# Altium schematic sheet Sheet1.SCHDOC
size 420 x 297 mm; SheetNumber: 1; SheetTotal: 1; Scale: {Масш.}; Title1str: {Наименование}; PageSetup: Record=PageOptions|CenterHorizontal=False|CenterVertical=False|PrintScale=0.95|XCorrection=0.00|YCorrection=0.00|PrintKind=1|BorderSize=5000000|LeftOffset=0|BottomOffset=0|Orientation=1|PaperLength=1000|PaperWidth=1000|Scale=100|PaperSource=15|PrintQuality=600|MediaType=1|DitherType=10|PaperKind=A4|PrintScaleMode=1; Title2str: {Наименование}; ProcessInspection: {Т.контр.}; Mass: {Масса}; NormInspection: {Н.контр.}; EngineerName: {Инженер}; Letter1Column: {}; Letter2Column: {}; Letter3Column: {}; DocumentType: {Документ}; DocumentType1str: {Документ}; DocumentType2str: {Документ}; DocumentName: Sheet1.SCHDOC
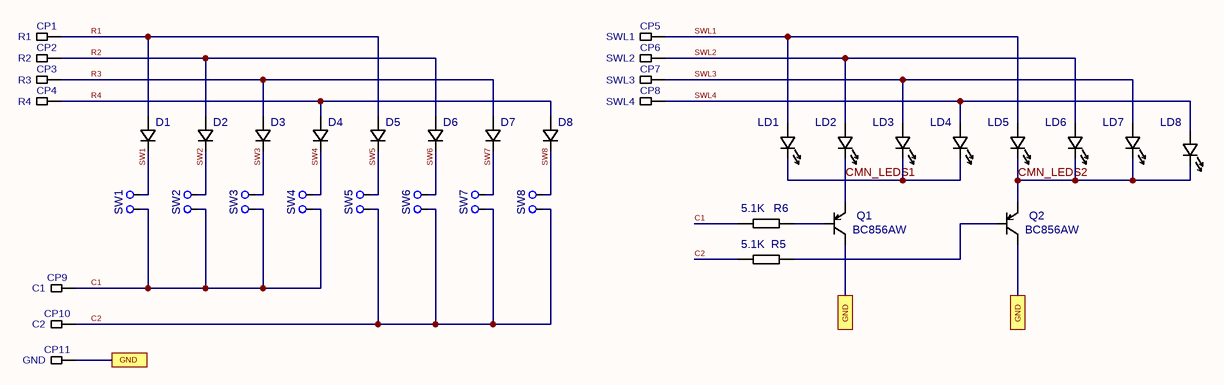
[diagram p0: Sheet1.SCHDOC]

## Parts
CP1  value R1  [PAD_RRX60Y60D0T]  (hidden comment: PAD_RRX60Y60D0T)
CP2  value R2  [PAD_RRX60Y60D0T]  (hidden comment: PAD_RRX60Y60D0T)
CP3  value R3  [PAD_RRX60Y60D0T]  (hidden comment: PAD_RRX60Y60D0T)
CP4  value R4  [PAD_RRX60Y60D0T]  (hidden comment: PAD_RRX60Y60D0T)
CP5  value SWL1  [PAD_RRX60Y60D0T]  (hidden comment: PAD_RRX60Y60D0T)
CP6  value SWL2  [PAD_RRX60Y60D0T]  (hidden comment: PAD_RRX60Y60D0T)
CP7  value SWL3  [PAD_RRX60Y60D0T]  (hidden comment: PAD_RRX60Y60D0T)
CP8  value SWL4  [PAD_RRX60Y60D0T]  (hidden comment: PAD_RRX60Y60D0T)
CP9  value C1  [PAD_RRX60Y60D0T]  (hidden comment: PAD_RRX60Y60D0T)
CP10  value C2  [PAD_RRX60Y60D0T]  (hidden comment: PAD_RRX60Y60D0T)
CP11  value GND  [PAD_RRX60Y60D0T]  (hidden comment: PAD_RRX60Y60D0T)
D1  1N4148  [SOD80]  (value not drawn)
D2  1N4148  [SOD80]  (value not drawn)
D3  1N4148  [SOD80]  (value not drawn)
D4  1N4148  [SOD80]  (value not drawn)
D5  1N4148  [SOD80]  (value not drawn)
D6  1N4148  [SOD80]  (value not drawn)
D7  1N4148  [SOD80]  (value not drawn)
D8  1N4148  [SOD80]  (value not drawn)
LD1  LED_3MM  [LED_3MM_DIP]  (value not drawn)
LD2  LED_3MM  [LED_3MM_DIP]  (value not drawn)
LD3  LED_3MM  [LED_3MM_DIP]  (value not drawn)
LD4  LED_3MM  [LED_3MM_DIP]  (value not drawn)
LD5  LED_3MM  [LED_3MM_DIP]  (value not drawn)
LD6  LED_3MM  [LED_3MM_DIP]  (value not drawn)
LD7  LED_3MM  [LED_3MM_DIP]  (value not drawn)
LD8  LED_3MM  [LED_3MM_DIP]  (value not drawn)
Q1  BC856AW  [SOT23]
Q2  BC856AW  [SOT23]
R5  value 5.1K  [R0805]  (hidden comment: RES_SMD_0805)
R6  value 5.1K  [R0805]  (hidden comment: RES_SMD_0805)
SW1  2P:EX60Y60D0T-CD100  [2P:EX60Y60D0T-CD100]  (value not drawn)
SW2  2P:EX60Y60D0T-CD100  [2P:EX60Y60D0T-CD100]  (value not drawn)
SW3  2P:EX60Y60D0T-CD100  [2P:EX60Y60D0T-CD100]  (value not drawn)
SW4  2P:EX60Y60D0T-CD100  [2P:EX60Y60D0T-CD100]  (value not drawn)
SW5  2P:EX60Y60D0T-CD100  [2P:EX60Y60D0T-CD100]  (value not drawn)
SW6  2P:EX60Y60D0T-CD100  [2P:EX60Y60D0T-CD100]  (value not drawn)
SW7  2P:EX60Y60D0T-CD100  [2P:EX60Y60D0T-CD100]  (value not drawn)
SW8  2P:EX60Y60D0T-CD100  [2P:EX60Y60D0T-CD100]  (value not drawn)

## Ports
GND

## Nets
C1: CP9.1 R6.1 SW1.2 SW2.2 SW3.2 SW4.2
C2: CP10.1 R5.1 SW5.2 SW6.2 SW7.2 SW8.2
CMN_LEDS1: LD1.K LD2.K LD3.K LD4.K Q1.2(E)
CMN_LEDS2: LD5.K LD6.K LD7.K LD8.K Q2.2(E)
GND: CP11.1 Q1.3(C) Q2.3(C) ; port GND
R1: CP1.1 D1.A D5.A
R2: CP2.1 D2.A D6.A
R3: CP3.1 D3.A D7.A
R4: CP4.1 D4.A D8.A
SW1: D1.K SW1.1
SW2: D2.K SW2.1
SW3: D3.K SW3.1
SW4: D4.K SW4.1
SW5: D5.K SW5.1
SW6: D6.K SW6.1
SW7: D7.K SW7.1
SW8: D8.K SW8.1
SWL1: CP5.1 LD1.A LD5.A
SWL2: CP6.1 LD2.A LD6.A
SWL3: CP7.1 LD3.A LD7.A
SWL4: CP8.1 LD4.A LD8.A
NetQ1_1: Q1.1(B) R6.2
NetQ2_1: Q2.1(B) R5.2

## Notes on the sheet
- Перв. примен.
- Справ. №
- Подп. и дата
- Инв. № дубл.
- Взам. инв. №
- Изм.
- Лист
- № докум.
- Подп.
- Дата
- Лит.
- Масса
- Масштаб
- Т.контр.
- Пров.
- Разраб.
- Листов
- Инв. № подл.
- Н.контр.
- Утв.
- Копировал
- Формат А3

## Library data of the parts
D1-D8 = 1N4148: Value: *
LD1-LD8 = LED_3MM: Value: *
Q1 Q2 = BC856AW: Value: *
SW1-SW8 = 2P:EX60Y60D0T-CD100: Value: *